# Altium schematic sheet Sheet1.SchDoc
size A3
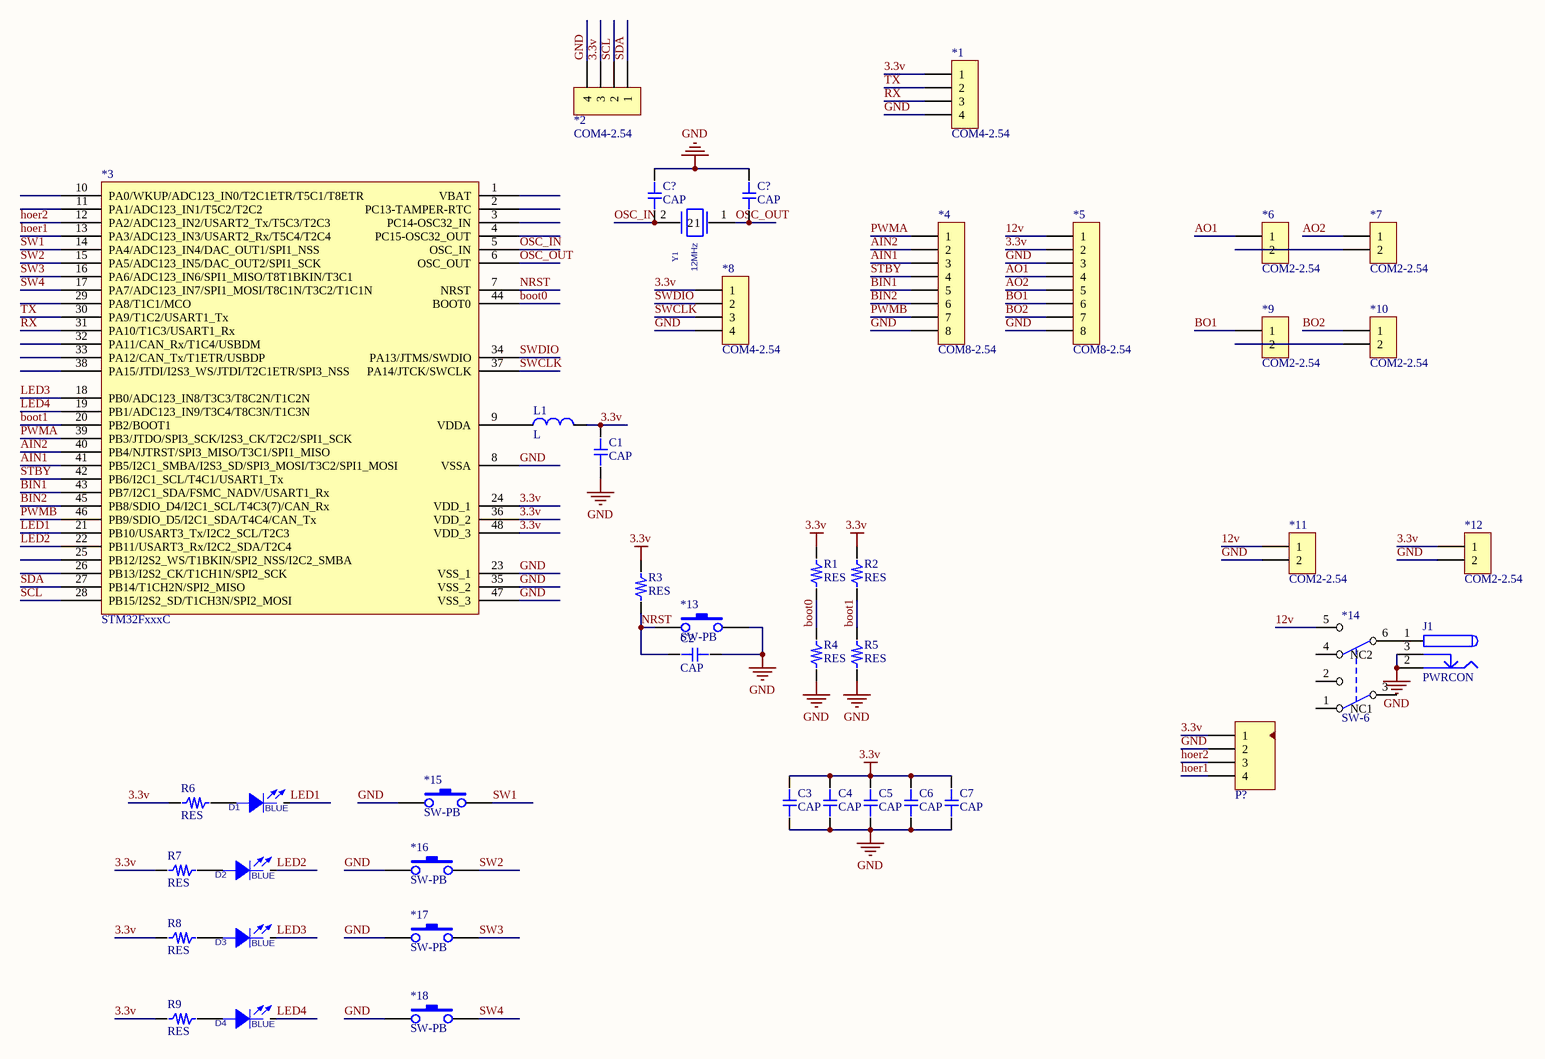
[diagram p0: Sheet1.SchDoc]

## Parts
(Parts that share a designator on the sheet are numbered #1, #2 ... from top to bottom, then left to right.)
*1  COM4-2.54  [COM4-2.54]
*2  COM4-2.54  [COM4-2.54]
*3  STM32FxxxC  [LQFP48]
*4  COM8-2.54  [COM8-2.54]
*5  COM8-2.54  [COM8-2.54]
*6  COM2-2.54  [COM2-2.54]
*7  COM2-2.54  [COM2-2.54]
*8  COM4-2.54  [COM4-2.54]
*9  COM2-2.54  [COM2-2.54]
*10  COM2-2.54  [COM2-2.54]
*11  COM2-2.54  [COM2-2.54]
*12  COM2-2.54  [COM2-2.54]
*13  SW-PB  [SW-PB1]
*14  SW-6  [SW-6]
*15  SW-PB  [SW-PB1]
*16  SW-PB  [SW-PB1]
*17  SW-PB  [SW-PB1]
*18  SW-PB  [SW-PB1]
C1  CAP  [C_0603]
C2  CAP  [C_0603]
C3  CAP  [C_0603]
C4  CAP  [C_0603]
C5  CAP  [C_0603]
C6  CAP  [C_0603]
C7  CAP  [C_0603]
C?#1  CAP  [C_0603]
C?#2  CAP  [C_0603]
D1  value BLUE  [LED_0603]  (hidden comment: LED)
D2  value BLUE  [LED_0603]  (hidden comment: LED)
D3  value BLUE  [LED_0603]  (hidden comment: LED)
D4  value BLUE  [LED_0603]  (hidden comment: LED)
J1  PWRCON  [DC-005]
L1  L  [L-0603]
P?  Header 4  [XH2.54-4P]  (value not drawn)
R1  RES  [R_0603]
R2  RES  [R_0603]
R3  RES  [R_0603]
R4  RES  [R_0603]
R5  RES  [R_0603]
R6  RES  [R_0603]
R7  RES  [R_0603]
R8  RES  [R_0603]
R9  RES  [R_0603]
Y1  value 12MHz  [XTAL_DIP]  (hidden comment: XTAL_49US)

## Nets
3.3v: *1.1 *2.3 *3.24(VDD_1) *3.36(VDD_2) *3.48(VDD_3) *5.2 *8.1 *12.1 C1.2 C3.2 C4.2 C5.2 C6.2 C7.2 L1.2 P?.1 R1.2 R2.2 R3.2 R6.2 R7.2 R8.2 R9.2
GND: *1.4 *2.4 *3.8(VSSA) *3.23(VSS_1) *3.35(VSS_2) *3.47(VSS_3) *4.8 *5.3 *5.8 *8.4 *11.2 *12.2 *13.2 *15.1 *16.1 *17.1 *18.1 C1.1 C2.2 C3.1 C4.1 C5.1 C6.1 C7.1 C?#1.2 C?#2.2 J1.2 J1.3 P?.2 R4.1 R5.1
12v: *5.1 *11.1 *14.5(NO2)
AIN1: *3.41(PB5/I2C1_SMBA/I2S3_SD/SPI3_MOSI/T3C2/SPI1_MOSI) *4.3
AIN2: *3.40(PB4/NJTRST/SPI3_MISO/T3C1/SPI1_MISO) *4.2
AO1: *5.4 *6.1
AO2: *5.5 *7.1
BIN1: *3.43(PB7/I2C1_SDA/FSMC_NADV/USART1_Rx) *4.5
BIN2: *3.45(PB8/SDIO_D4/I2C1_SCL/T4C3(7)/CAN_Rx) *4.6
BO1: *5.6 *9.1
BO2: *5.7 *10.1
boot0: *3.44(BOOT0) R1.1 R4.2
boot1: *3.20(PB2/BOOT1) R2.1 R5.2
hoer1: *3.13(PA3/ADC123_IN3/USART2_Rx/T5C4/T2C4) P?.4
hoer2: *3.12(PA2/ADC123_IN2/USART2_Tx/T5C3/T2C3) P?.3
LED1: *3.21(PB10/USART3_Tx/I2C2_SCL/T2C3) D1.2(CATHODE)
LED2: *3.22(PB11/USART3_Rx/I2C2_SDA/T2C4) D2.2(CATHODE)
LED3: *3.18(PB0/ADC123_IN8/T3C3/T8C2N/T1C2N) D3.2(CATHODE)
LED4: *3.19(PB1/ADC123_IN9/T3C4/T8C3N/T1C3N) D4.2(CATHODE)
NRST: *3.7(NRST) *13.1 C2.1 R3.1
OSC_IN: *3.5(OSC_IN) C?#1.1 Y1.2
OSC_OUT: *3.6(OSC_OUT) C?#2.1 Y1.1
PWMA: *3.39(PB3/JTDO/SPI3_SCK/I2S3_CK/T2C2/SPI1_SCK) *4.1
PWMB: *3.46(PB9/SDIO_D5/I2C1_SDA/T4C4/CAN_Tx) *4.7
RX: *1.3 *3.31(PA10/T1C3/USART1_Rx)
SCL: *2.2 *3.28(PB15/I2S2_SD/T1CH3N/SPI2_MOSI)
SDA: *2.1 *3.27(PB14/T1CH2N/SPI2_MISO)
STBY: *3.42(PB6/I2C1_SCL/T4C1/USART1_Tx) *4.4
SW1: *3.14(PA4/ADC123_IN4/DAC_OUT1/SPI1_NSS) *15.2
SW2: *3.15(PA5/ADC123_IN5/DAC_OUT2/SPI1_SCK) *16.2
SW3: *3.16(PA6/ADC123_IN6/SPI1_MISO/T8T1BKIN/T3C1) *17.2
SW4: *3.17(PA7/ADC123_IN7/SPI1_MOSI/T8C1N/T3C2/T1C1N) *18.2
SWCLK: *3.37(PA14/JTCK/SWCLK) *8.3
SWDIO: *3.34(PA13/JTMS/SWDIO) *8.2
TX: *1.2 *3.30(PA9/T1C2/USART1_Tx)
Net*3_9: *3.9(VDDA) L1.1
Net*6_2: *6.2 *7.2
Net*9_2: *9.2 *10.2
Net*14_6: *14.6(COMMON2) J1.1
NetD1_1: D1.1(ANODE) R6.1
NetD2_1: D2.1(ANODE) R7.1
NetD3_1: D3.1(ANODE) R8.1
NetD4_1: D4.1(ANODE) R9.1

Not connected (* = marked no-connect by the designer): *3 1(VBAT) 2(PC13-TAMPER-RTC) 3(PC14-OSC32_IN) 4(PC15-OSC32_OUT) 10(PA0/WKUP/ADC123_IN0/T2C1ETR/T5C1/T8ETR) 11(PA1/ADC123_IN1/T5C2/T2C2) 25(PB12/I2S2_WS/T1BKIN/SPI2_NSS/I2C2_SMBA) 26(PB13/I2S2_CK/T1CH1N/SPI2_SCK) 29(PA8/T1C1/MCO) 32(PA11/CAN_Rx/T1C4/USBDM) 33(PA12/CAN_Tx/T1ETR/USBDP) 38(PA15/JTDI/I2S3_WS/JTDI/T2C1ETR/SPI3_NSS); *14 1(NC1) 2(NO1) 3(COMMON1) 4(NC2)

## Library data of the parts
J1 = PWRCON: 直流电源端子; Published: 17-Dec-2003; DatasheetDocument: 09-May-2002; Publisher: Altium Limited; ComponentLink1Description: Manufacturer Link; ComponentLink1URL: http://domino.kycon.com/internet/Products.html
P? = Header 4: 接插件; LatestRevisionDate: 17-Jul-2002; LatestRevisionNote: Re-released for DXP Platform.; Publisher: Altium Limited
Y1 = XTAL_49US: PCB DECAL: XTAL_SMD
D1-D4 = LED: PCB DECAL: LED_0603